# EAGLE design a718-noise-source (EAGLE 7.6.0)
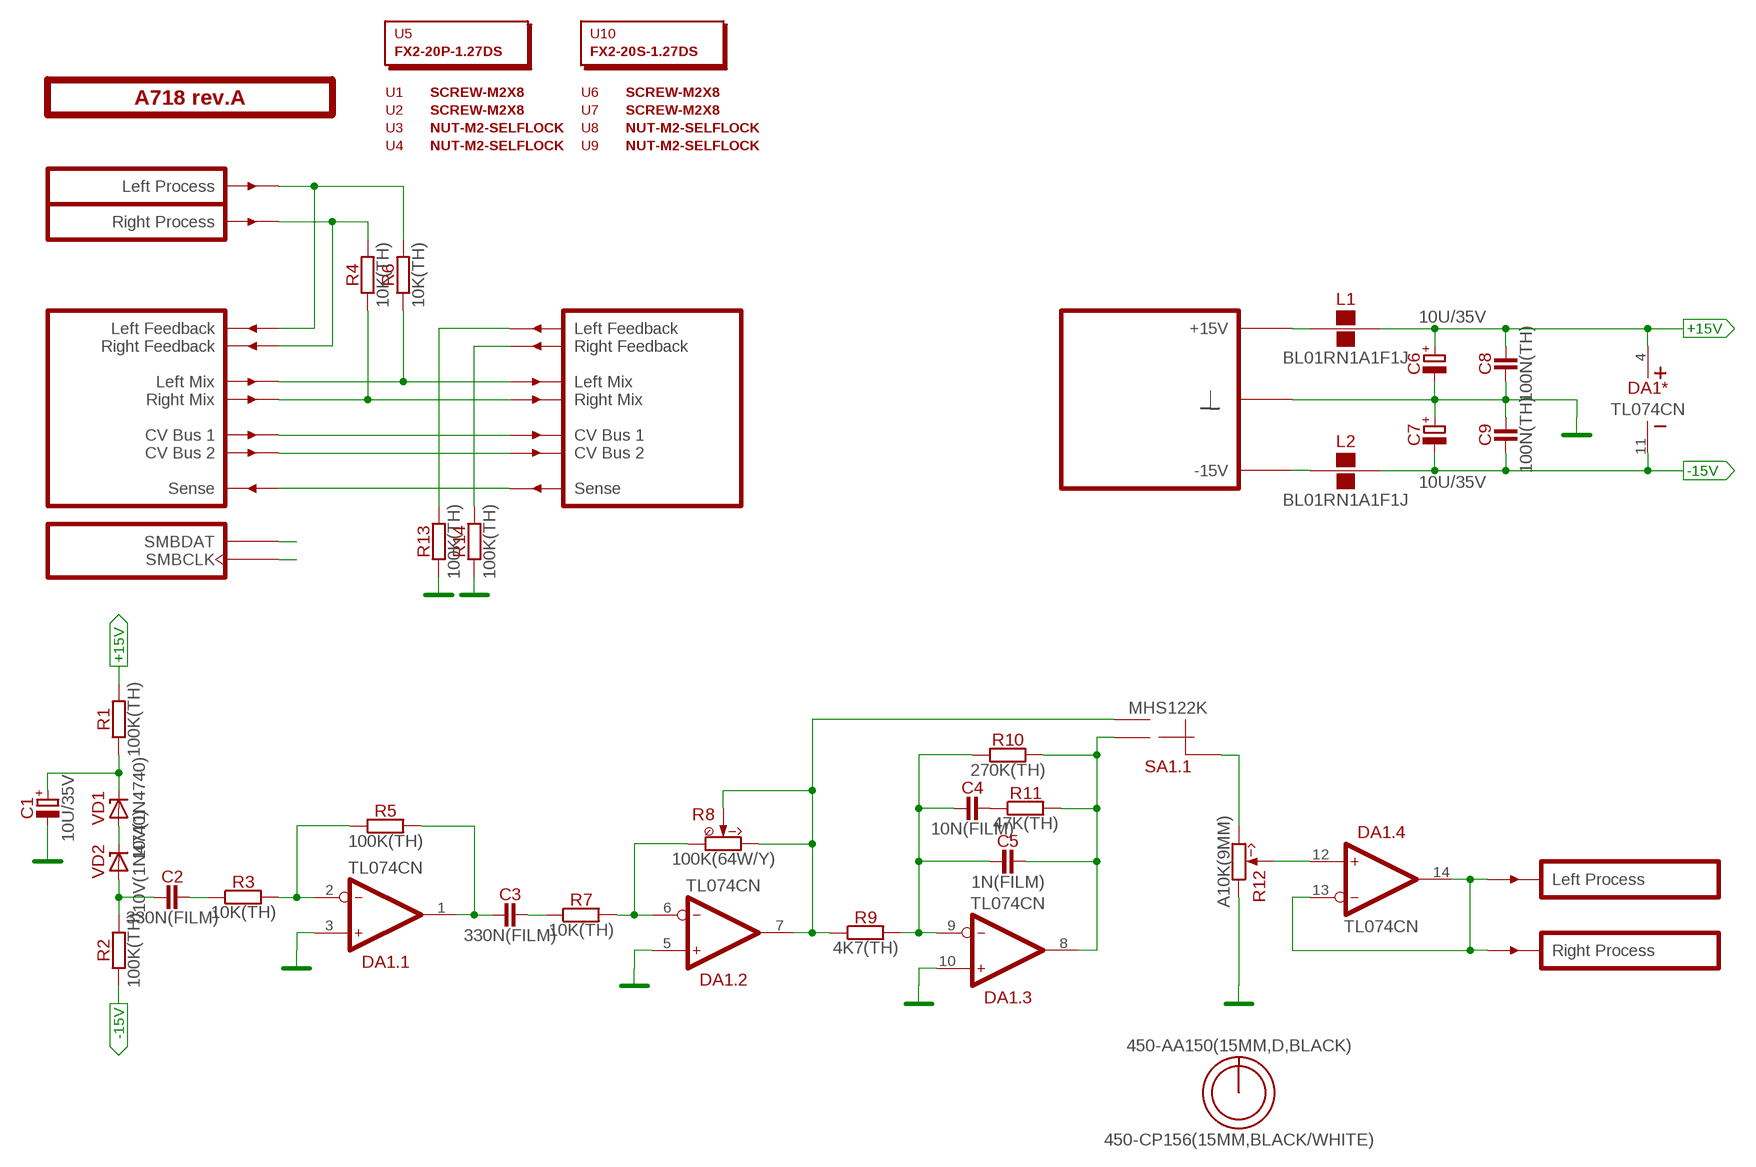
[diagram p0: schematic, sheet 1]

## Parts
C1  10U/35V  [E2-5]
C2  330N(FILM)  [C050-035X075]
C3  330N(FILM)  [C050-035X075]
C4  10N(FILM)  [C050-025X075]
C5  1N(FILM)  [C050-025X075]
C6  10U/35V  [E2-5]
C7  10U/35V  [E2-5]
C8  100N(TH)  [C050-024X044]
C9  100N(TH)  [C050-024X044]
DA1  TL074CN  [DIP-14]
L1  BL01RN1A1F1J  [BL01RN1A]
L2  BL01RN1A1F1J  [BL01RN1A]
O1  450-AA150(15MM,D,BLACK)  [EMPTY]
O2  450-CP156(15MM,BLACK/WHITE)  [EMPTY]
PCB1  A718 rev.A  ST2-BOARD-50  [ST2-BOARD-50]
R1  100K(TH)  [R-0207/10]
R2  100K(TH)  [R-0207/10]
R3  10K(TH)  [R-0207/10]
R4  10K(TH)  [R-0207/10]
R5  100K(TH)  [R-0207/10]
R6  10K(TH)  [R-0207/10]
R7  10K(TH)  [R-0207/10]
R8  100K(64W/Y)  [64W]
R9  4K7(TH)  [R-0207/10]
R10  270K(TH)  [R-0207/10]
R11  47K(TH)  [R-0207/10]
R12  A10K(9MM)  [RV09-SINGLE]
R13  100K(TH)  [R-0207/10]
R14  100K(TH)  [R-0207/10]
SA1  MHS122K  [APEM-MHS122K]
U1  SCREW-M2X8  [EMPTY]
U2  SCREW-M2X8  [EMPTY]
U3  NUT-M2-SELFLOCK  [EMPTY]
U4  NUT-M2-SELFLOCK  [EMPTY]
U5  FX2-20P-1.27DS  [EMPTY]
U6  SCREW-M2X8  [EMPTY]
U7  SCREW-M2X8  [EMPTY]
U8  NUT-M2-SELFLOCK  [EMPTY]
U9  NUT-M2-SELFLOCK  [EMPTY]
U10  FX2-20S-1.27DS  [EMPTY]
VD1  10V(1N4740)  [DO41-10]
VD2  10V(1N4740)  [DO41-10]

## Nets
+15V [power]: C6.+ C8.2 DA1.4(*:V+) L1.2 R1.2
-15V: C7.- C9.1 DA1.11(*:V-) L2.2 R2.1
GND: C1.- C6.- C7.+ C8.1 C9.2 DA1.3(.1:IN+) DA1.5(.2:IN+) DA1.10(.3:IN+) PCB1.B4'(GND) PCB1.B4(GND) PCB1.B5'(GND) PCB1.B5(GND) PCB1.B6'(GND) PCB1.B6(GND) PCB1.B7'(GND) PCB1.B7(GND) PCB1.B8'(GND) PCB1.B8(GND) R12.1(CCW) R13.1 R14.1
LMIX: PCB1.ALMIX'(LMIX') PCB1.ALMIX(LMIX) R6.1
N$1: L1.1 PCB1.A+15'(P+15V) PCB1.A+15(P+15V) PCB1.B+15'(P+15V) PCB1.B+15(P+15V)
N$2: C1.+ R1.1 VD1.C
N$3: PCB1.ARFBK'(RFBK') R14.2
N$4: VD1.A VD2.C
N$5: L2.1 PCB1.A-15'(P-15V) PCB1.A-15(P-15V) PCB1.B-15'(P-15V) PCB1.B-15(P-15V)
N$6: PCB1.ALFBK'(LFBK') R13.2
N$7: C2.1 R2.2 VD2.A
N$8: C4.1 C5.1 DA1.9(.3:IN-) R9.2 R10.1
N$9: C2.2 R3.1
N$10: DA1.2(.1:IN-) R3.2 R5.1
N$11: C3.1 DA1.1(.1:OUT) R5.2
N$12: C3.2 R7.1
N$13: DA1.6(.2:IN-) R7.2 R8.1(CCW)
N$14: DA1.7(.2:OUT) R8.3(CW) R8.S(W) R8.S@1(W) R9.1 SA1.2
N$15: C4.2 R11.1
N$16: PCB1.BSENSE'(SENSE') PCB1.BSENSE(SENSE)
N$17: PCB1.ARFBK(RFBK) PCB1.BINR(INR) R4.2
N$18: PCB1.ALFBK(LFBK) PCB1.BINL(INL) R6.2
N$19: C5.2 DA1.8(.3:OUT) R10.2 R11.2 SA1.1
N$20: R12.3(CW) SA1.CMN(.1:CM)
N$21: DA1.12(.4:IN+) R12.2(W)
N$22: DA1.13(.4:IN-) DA1.14(.4:OUT) PCB1.BOUTL'(OUTL) PCB1.BOUTR'(OUTR)
N$38: PCB1.ASMBDAT'(SMBDAT) PCB1.ASMBDAT(SMBDAT)
N$41: PCB1.ACV1'(CV1') PCB1.ACV1(CV1)
N$42: PCB1.ACV2'(CV2') PCB1.ACV2(CV2)
N$43: PCB1.ASMBCLK'(SMBCLK) PCB1.ASMBCLK(SMBCLK)
RMIX: PCB1.ARMIX'(RMIX') PCB1.ARMIX(RMIX) R4.1
Unconnected: SA1.1' SA1.2' SA1.CMN'(.2:CM)

## Library data of the parts
C1 C6 C7 = capacitors-electrolytic:?; MOUSER: 647-USW1V100MDD
C2 C3 = capacitors:?; MOUSER: 505-MKS2.33/63/10
C4 = capacitors:?; MOUSER: 80-F622JF103J100C
C5 = capacitors:?
C8 C9 = capacitors:?; MOUSER: 81-RCER71H104K0A2H3B
DA1 = ic-ti:TL074
L1 L2 = inductors:BL01RN1A?; MOUSER: 81-BL01RN1A1F1J
O1 = hardware:450-AA?; MOUSER: 450-AA150
O2 = hardware:450-C?; MOUSER: 450-CP156
PCB1 = module-footprints:ST2-BOARD-?
R1 R2 R5 R13 R14 = resistors:?; MOUSER: 71-RN55D-F-100K
R3 R4 R6 R7 = resistors:?; MOUSER: 71-RN55D-F-10K
R8 = potentiometers:?(64W/Y)
R9-R11 = resistors:?
R12 = potentiometers:?; MOUSER: 652-PTV09A4025FA103
SA1 = switches:MHS122K; MOUSER: 642-MHS122K
U1-U4 U6-U9 = hardware:*?
U5 = hardware:?; MOUSER: 798-FX2-20P-1.27DS71
U10 = hardware:?; MOUSER: 798-FX2-20S-1.27DS71
VD1 VD2 = diodes-zener:?

## Board
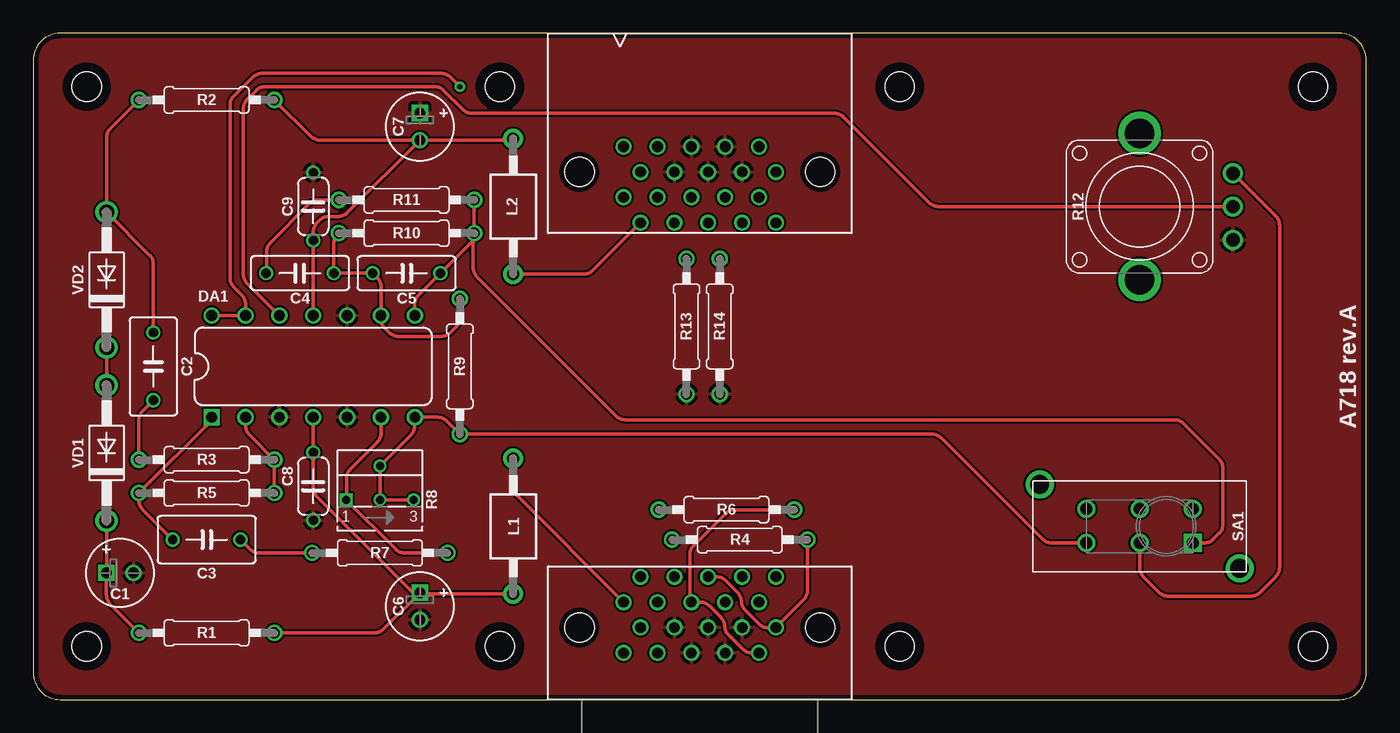
[diagram p1: board, top side]
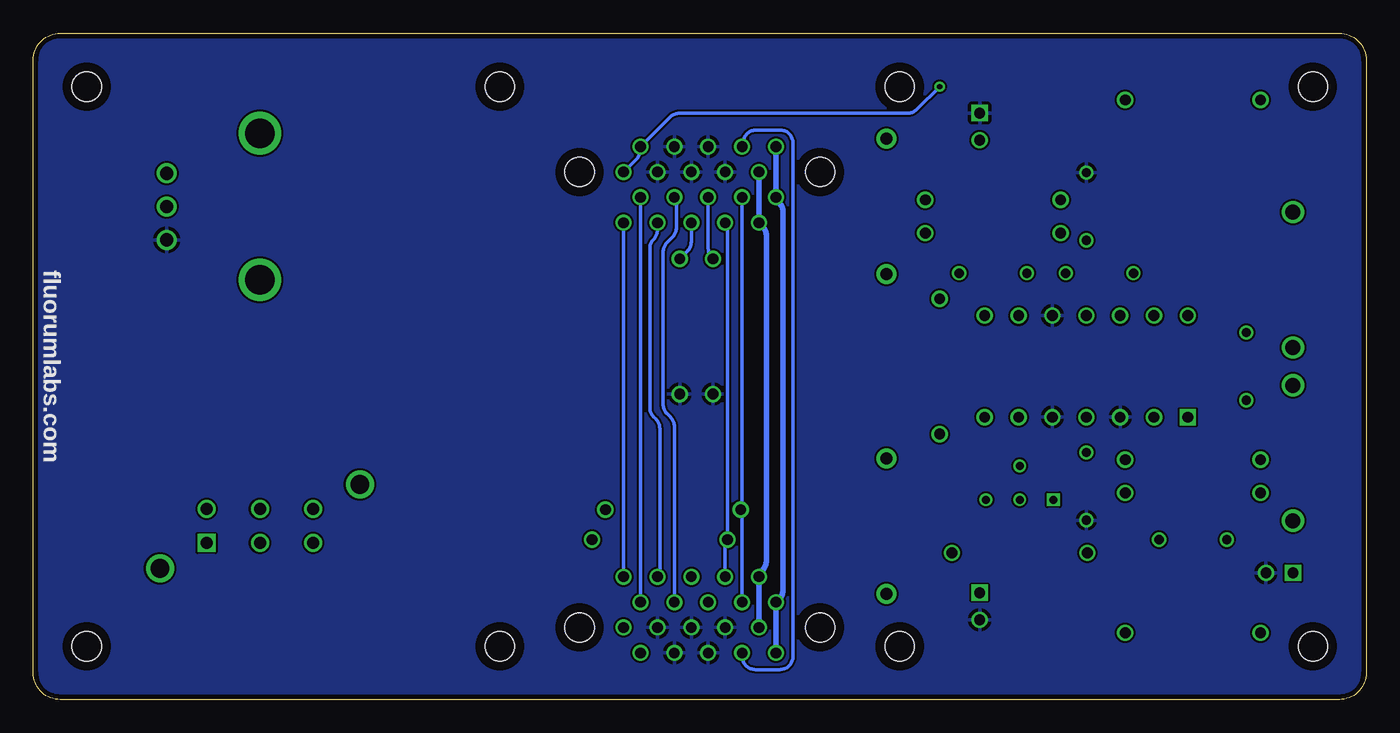
[diagram p2: board, bottom side, seen from below]

Size 100 x 50 mm. Coordinates in mm from the lower left corner, seen from the top.
Outline: 0,48 0,2 arc90 2,0 98,0 arc90 100,2 100,48 arc90 98,50 2,50 arc90 0,48
Copper layers (1*16): Top 0.0356mm / dielectric 1.5011mm / Bottom 0.0356mm
Design rules "LaenPCBOrder": minimum track width 6mil, minimum drill 13mil, track to track 6mil, track to pad 6mil, pad to pad 6mil, via to via 6mil, smd to smd 6mil, copper to edge 15mil, drill to drill 6mil, minimum pad ring 7mil, minimum via ring 7mil, stop-mask expansion 3mil, vias tented up to drill 0mil, thermal gap 10mil

### Footprints (pad centres in the part's own frame; a part is rotated, then mirrored left to right if it is on the bottom)
E2-5 = drill 0.813 square: + -1.016,0 | drill 0.813: - 1.016,0
C050-035X075 = drill 0.7: 1 -2.54,0; 2 2.54,0
C050-025X075 = drill 0.7: 1 -2.54,0; 2 2.54,0
C050-024X044 = drill 0.7: 1 -2.54,0; 2 2.54,0
DIP-14 = drill 0.813 square: 1 -7.62,-3.81 | drill 0.813: 2 -5.08,-3.81; 3 -2.54,-3.81; 4 0,-3.81; 5 2.54,-3.81; 6 5.08,-3.81; 7 7.62,-3.81; 8 7.62,3.81; 9 5.08,3.81; 10 2.54,3.81; 11 0,3.81; 12 -2.54,3.81; 13 -5.08,3.81; 14 -7.62,3.81
BL01RN1A = drill 0.9 pad 1.5: 1 -5.08,0; 2 5.08,0
ST2-BOARD-50 = drill 0.8: A+15 44.285,7.31; A+15' 44.285,37.69; A-15 45.555,9.215; A-15' 45.555,35.785; ACV1 51.905,7.31; ACV1' 51.905,37.69; ACV2 53.175,9.215; ACV2' 53.175,35.785; ALFBK 49.365,7.31; ALFBK' 49.365,37.69; ALMIX 46.825,7.31; ALMIX' 46.825,37.69; ARFBK 50.635,9.215; ARFBK' 50.635,35.785; ARMIX 48.095,9.215; ARMIX' 48.095,35.785; ASMBCLK 55.715,9.215; ASMBCLK' 55.715,35.785; ASMBDAT 54.445,7.31; ASMBDAT' 54.445,37.69; B4 48.095,5.405; B4' 48.095,39.595; B5 49.365,3.5; B5' 49.365,41.5; B6 50.635,5.405; B6' 50.635,39.595; B7 51.905,3.5; B7' 51.905,41.5; B8 53.175,5.405; B8' 53.175,39.595; B+15 44.285,3.5; B+15' 44.285,41.5; B-15 45.555,5.405; B-15' 45.555,39.595; BINL 54.445,3.5; BINR 55.715,5.405; BOUTL' 54.445,41.5; BOUTR' 55.715,39.595; BSENSE 46.825,3.5; BSENSE' 46.825,41.5 | hole 2.2: 4,4; 4,46; 96,4; 96,46; 35,46; 65,46; 65,4; 35,4; 59.025,5.405; 40.975,5.405; 40.975,39.595; 59.025,39.595
R-0207/10 = drill 0.813: 1 -5.08,0; 2 5.08,0
64W = drill 0.6 square: 1 2.54,0 | drill 0.6: 3 -2.54,0; S 0,-2.54; S@1 0,0
RV09-SINGLE = drill 1: 1 -2.5,-7; 2 0,-7; 3 2.5,-7 | drill 2.2: S1 -5.5,0; S2 5.5,0
APEM-MHS122K = drill 0.9 square: 1 -4,1.25 | drill 0.9: 1' -4,-1.29; 2 4,1.25; 2' 4,-1.29; CMN 0,1.25; CMN' 0,-1.29 | drill 1.4: S1 -7.5,3.15; S2 7.5,-3.15
DO41-10 = drill 1.118: A 5.08,0; C -5.08,0

### Placement (x,y rotation side)
C1  6.5,9.5 0 top
C2  9,25 270 top
C3  13,12 0 top
C4  20,32 180 top
C5  28,32 0 top
C6  29,7 270 top
C7  29,43 270 top
C8  21,16 90 top
C9  21,37 90 top
DA1  21,25 0 top
L1  36,13 270 top
L2  36,37 90 top
O1  -8,-87 0 top  (outside the outline)
O2  -9,-89 0 top  (outside the outline)
PCB1  0,0 0 top
R1  13,5 0 top
R2  13,45 180 top
R3  13,18 0 top
R4  53,12 0 top
R5  13,15.5 180 top
R6  52,14.25 0 top
R7  26,11 0 top
R8  26,15 180 top
R9  32,25 90 top
R10  28,35 0 top
R11  28,37.5 0 top
R12  83,37 90 top
R13  49,28 90 top
R14  51.5,28 90 top
SA1  83,13 180 top
U1  40,-85 0 top  (outside the outline)
U2  43,-85 0 top  (outside the outline)
U3  46,-85 0 top  (outside the outline)
U4  49,-85 0 top  (outside the outline)
U5  52,-85 0 top  (outside the outline)
U6  55,-85 0 top  (outside the outline)
U7  58,-85 0 top  (outside the outline)
U8  61,-85 0 top  (outside the outline)
U9  64,-85 0 top  (outside the outline)
U10  67,-85 0 top  (outside the outline)
VD1  5.5,18.5 90 top
VD2  5.5,31.5 90 top

### Tracks (layer width: path | path; a pad name or v marks a point on that pad's centre or on a via)
+15V
  Top 0.254: DA1.4 C8.2 21,15.91 arc45 21.29,15.21 28.38,8.12 28.5,8 | R1.2 25.57,5 arc45 26.28,5.29 C6.+ 28.98,8 28.5,8 | L1.2 28.58,7.92 28.5,8
-15V
  Top 0.254: DA1.11 C9.1 21,35.09 arc-45 21.29,35.79 21.46,35.96 arc-45 22.16,36.25 22.85,36.25 arc45 23.56,36.54 C7.- | C7.- 21.51,41.98 arc-45 20.8,42.28 R2.1 | C7.- 35.9,41.98 L2.2
GND
  pour Top: 0,50 100,50 100,0 0,0
  pour Bottom: 0,50 100,50 100,0 0,0
LMIX
  Bottom 0.254: PCB1.ALMIX' 46.83,14.35 R6.1 46.83,14.15 PCB1.ALMIX
N$1
  Top 0.254: L1.1 36,16.01 arc45 36.29,15.3 PCB1.A+15
  Bottom 0.406: PCB1.B+15 PCB1.A+15 44.04,7.55 arc-45 43.75,8.26 43.75,36.59 arc-45 44.04,37.29 44.28,37.53 PCB1.A+15' PCB1.B+15'
N$2
  Top 0.254: VD1.C 5.5,9.52 C1.+ 5.48,7.85 arc45 5.78,7.14 R1.1
N$3
  Bottom 0.254: PCB1.ARFBK' 50.63,34.36 arc45 50.93,33.65 R14.2
N$4
  Top 0.254: VD2.C VD1.A
N$5
  Top 0.254: L2.1 41.28,31.92 arc45 41.98,32.21 PCB1.A-15'
  Bottom 0.406: PCB1.B-15 PCB1.A-15 45.55,9.45 45.29,9.71 arc-45 45,10.41 45,34.82 arc-45 45.29,35.52 PCB1.A-15' PCB1.B-15'
N$6
  Bottom 0.254: PCB1.ALFBK' 49.37,33.86 arc-45 49.07,33.15 R13.2
N$7
  Top 0.254: C2.1 9,32.67 arc45 8.71,33.37 VD2.A 5.5,42.17 arc-45 5.79,42.87 R2.2
N$8
  Top 0.254: R10.1 22.83,34.91 arc45 22.54,34.21 C4.1 C5.1 25.79,31.67 arc-45 26.08,30.97 DA1.9 26,28.73 26,28.66 arc45 26.29,27.96 26.71,27.54 arc45 27.41,27.25 30.59,27.25 arc45 31.29,27.54 31.71,27.96 arc45 32,28.66 R9.2
N$9
  Top 0.254: R3.1 7.92,20.97 arc-45 8.21,21.67 C2.2
N$10
  Top 0.254: R5.1 R3.2 16.21,19.87 arc-45 15.92,20.57 DA1.2
N$11
  Top 0.254: DA1.1 13.38,20.96 R5.2 7.92,14.95 arc45 8.21,14.25 C3.1
N$12
  Top 0.254: R7.1 16.95,11 arc-45 16.25,11.29 C3.2
N$13
  Top 0.254: DA1.6 26.08,19.99 arc-45 25.79,19.29 23.79,17.29 arc45 23.5,16.59 23.5,15.04 R8.1 27.17,11.29 arc45 27.87,11 R7.2
N$14
  Top 0.254: R8.3 R8.S@1 R8.S 28.33,19.87 arc45 28.62,20.57 DA1.7 30.32,21.19 arc-45 31.02,20.9 R9.1 67.42,19.92 arc-45 68.12,19.63 75.71,12.04 arc45 76.41,11.75 SA1.2
N$15
  Top 0.254: R11.1 21.41,37.5 arc45 20.71,37.21 17.79,34.29 arc45 17.5,33.59 17.5,32.04 C4.2
N$16
  Bottom 0.254: PCB1.BSENSE 46.83,3.25 arc-90 45.83,2.25 44,2.25 arc-90 43,3.25 43,41.75 arc-90 44,42.75 45.75,42.75 arc-90 46.75,41.75 46.75,41.58 PCB1.BSENSE'
N$17
  Top 0.254: PCB1.ARFBK 51.25,9.21 arc-45 51.95,8.92 52.83,8.04 arc-45 53.12,7.34 arc45 53.36,6.76 54.46,5.67 arc45 55.16,5.38 55.69,5.38 PCB1.BINR 57.79,7.48 arc45 58.08,8.18 R4.2
N$18
  Top 0.254: PCB1.BINL 53.91,3.5 arc-45 53.21,3.79 52.11,4.89 arc-45 51.88,5.46 arc45 51.58,6.17 50.73,7.02 arc45 50.03,7.31 PCB1.ALFBK 49.25,7.42 49.25,10.84 arc-45 49.54,11.54 51.96,13.96 arc-45 52.66,14.25 R6.2
N$19
  Top 0.254: DA1.8 28.62,29.67 arc-45 28.91,30.37 C5.2 33,34.46 | R11.2 R10.2 33.08,34.54 33.02,34.48 33,34.46 | SA1.1 87.84,11.75 arc45 88.54,12.04 88.96,12.46 arc45 89.25,13.16 89.25,17.34 arc45 88.96,18.04 86.29,20.71 arc45 85.59,21 44.41,21 arc-45 43.71,21.29 33.29,31.71 arc-45 33,32.41 33,34.46
N$20
  Top 0.254: SA1.CMN 83,9.91 arc45 83.29,9.21 84.46,8.04 arc45 85.16,7.75 91.34,7.75 arc45 92.04,8.04 93.21,9.21 arc45 93.5,9.91 93.5,35.59 arc45 93.21,36.29 R12.3
N$21
  Top 0.254: R12.2 67.91,37 arc-45 67.21,37.29 60.79,43.71 arc45 60.09,44 32.91,44 arc-45 32.21,44.29 30.79,45.71 arc45 30.09,46 17.41,46 arc45 16.71,45.71 16.04,45.04 arc45 15.75,44.34 15.75,31.93 arc45 16.04,31.23 DA1.12
N$22  (via drill 0.4)
  Top 0.254: DA1.14 DA1.13 15.92,29.67 arc45 15.63,30.37 15.04,30.96 arc-45 14.75,31.66 14.75,44.59 arc-45 15.04,45.29 16.46,46.71 arc-45 17.16,47 30.59,47 arc-45 31.29,46.71 v32,46
  Bottom 0.254: v32,46 33.71,44.29 arc45 34.41,44 51.53,44 arc-45 52.24,43.71 PCB1.BOUTL' 54.45,41.28 arc45 54.74,40.57 PCB1.BOUTR'
N$38
  Bottom 0.254: PCB1.ASMBDAT PCB1.ASMBDAT'
N$41
  Bottom 0.254: PCB1.ACV1 51.91,20.49 arc-45 52.2,21.2 52.46,21.46 arc45 52.75,22.16 52.75,33.59 arc45 52.46,34.29 52.04,34.71 arc-45 51.75,35.41 51.75,37.53 PCB1.ACV1'
N$42
  Bottom 0.254: PCB1.ACV2' 53.17,35.24 arc45 53.47,34.53 arc-45 53.75,33.85 53.75,21.91 arc-45 53.46,21.21 53.29,21.04 arc45 53,20.34 53,9.39 PCB1.ACV2
N$43
  Bottom 0.254: PCB1.ASMBCLK' PCB1.ASMBCLK
RMIX
  Bottom 0.254: PCB1.ARMIX 48.09,11.82 R4.1 47.92,35.61 PCB1.ARMIX'